# Altium project MD015A.PrjPcb (part 3 of 3)

## Sheet MD015A_MCU_USB2HUB.SchDoc
size 431 x 279 mm; Date: Not shown in title block; ApprovedBy: Not shown in title block; CheckedBy: Not shown in title block; Author: Not shown in title block; CompanyName: Not shown in title block; Engineer: Not shown in title block; Organization: Not shown in title block; Address1: Not shown in title block; Address2: Not shown in title block; Address3: Not shown in title block; Address4: Not shown in title block; DocumentNumber: 1; Revision: Use project parameter SCH_Rev; SheetNumber: 1; SheetTotal: 4; PageSetup: Record=PageOptions|CenterHorizontal=True|CenterVertical=True|PrintScale=1.00|XCorrection=1.00|YCorrection=1.00|PrintKind=0|BorderSize=5000000|LeftOffset=0|BottomOffset=0|Orientation=2|PaperLength=1000|PaperWidth=1000|Scale=100|PaperSource=15|PrintQuality=600|MediaType=1|DitherType=10|PaperKind=Letter|PrintScaleMode=1; CurrentTime: Not shown in title block; CurrentDate: Not shown in title block; Time: Not shown in title block; DocumentFullPathAndName: Not shown in title block; DocumentName: Not shown in title block; ModifiedDate: Not shown in title block; ImagePath: Not shown in title block
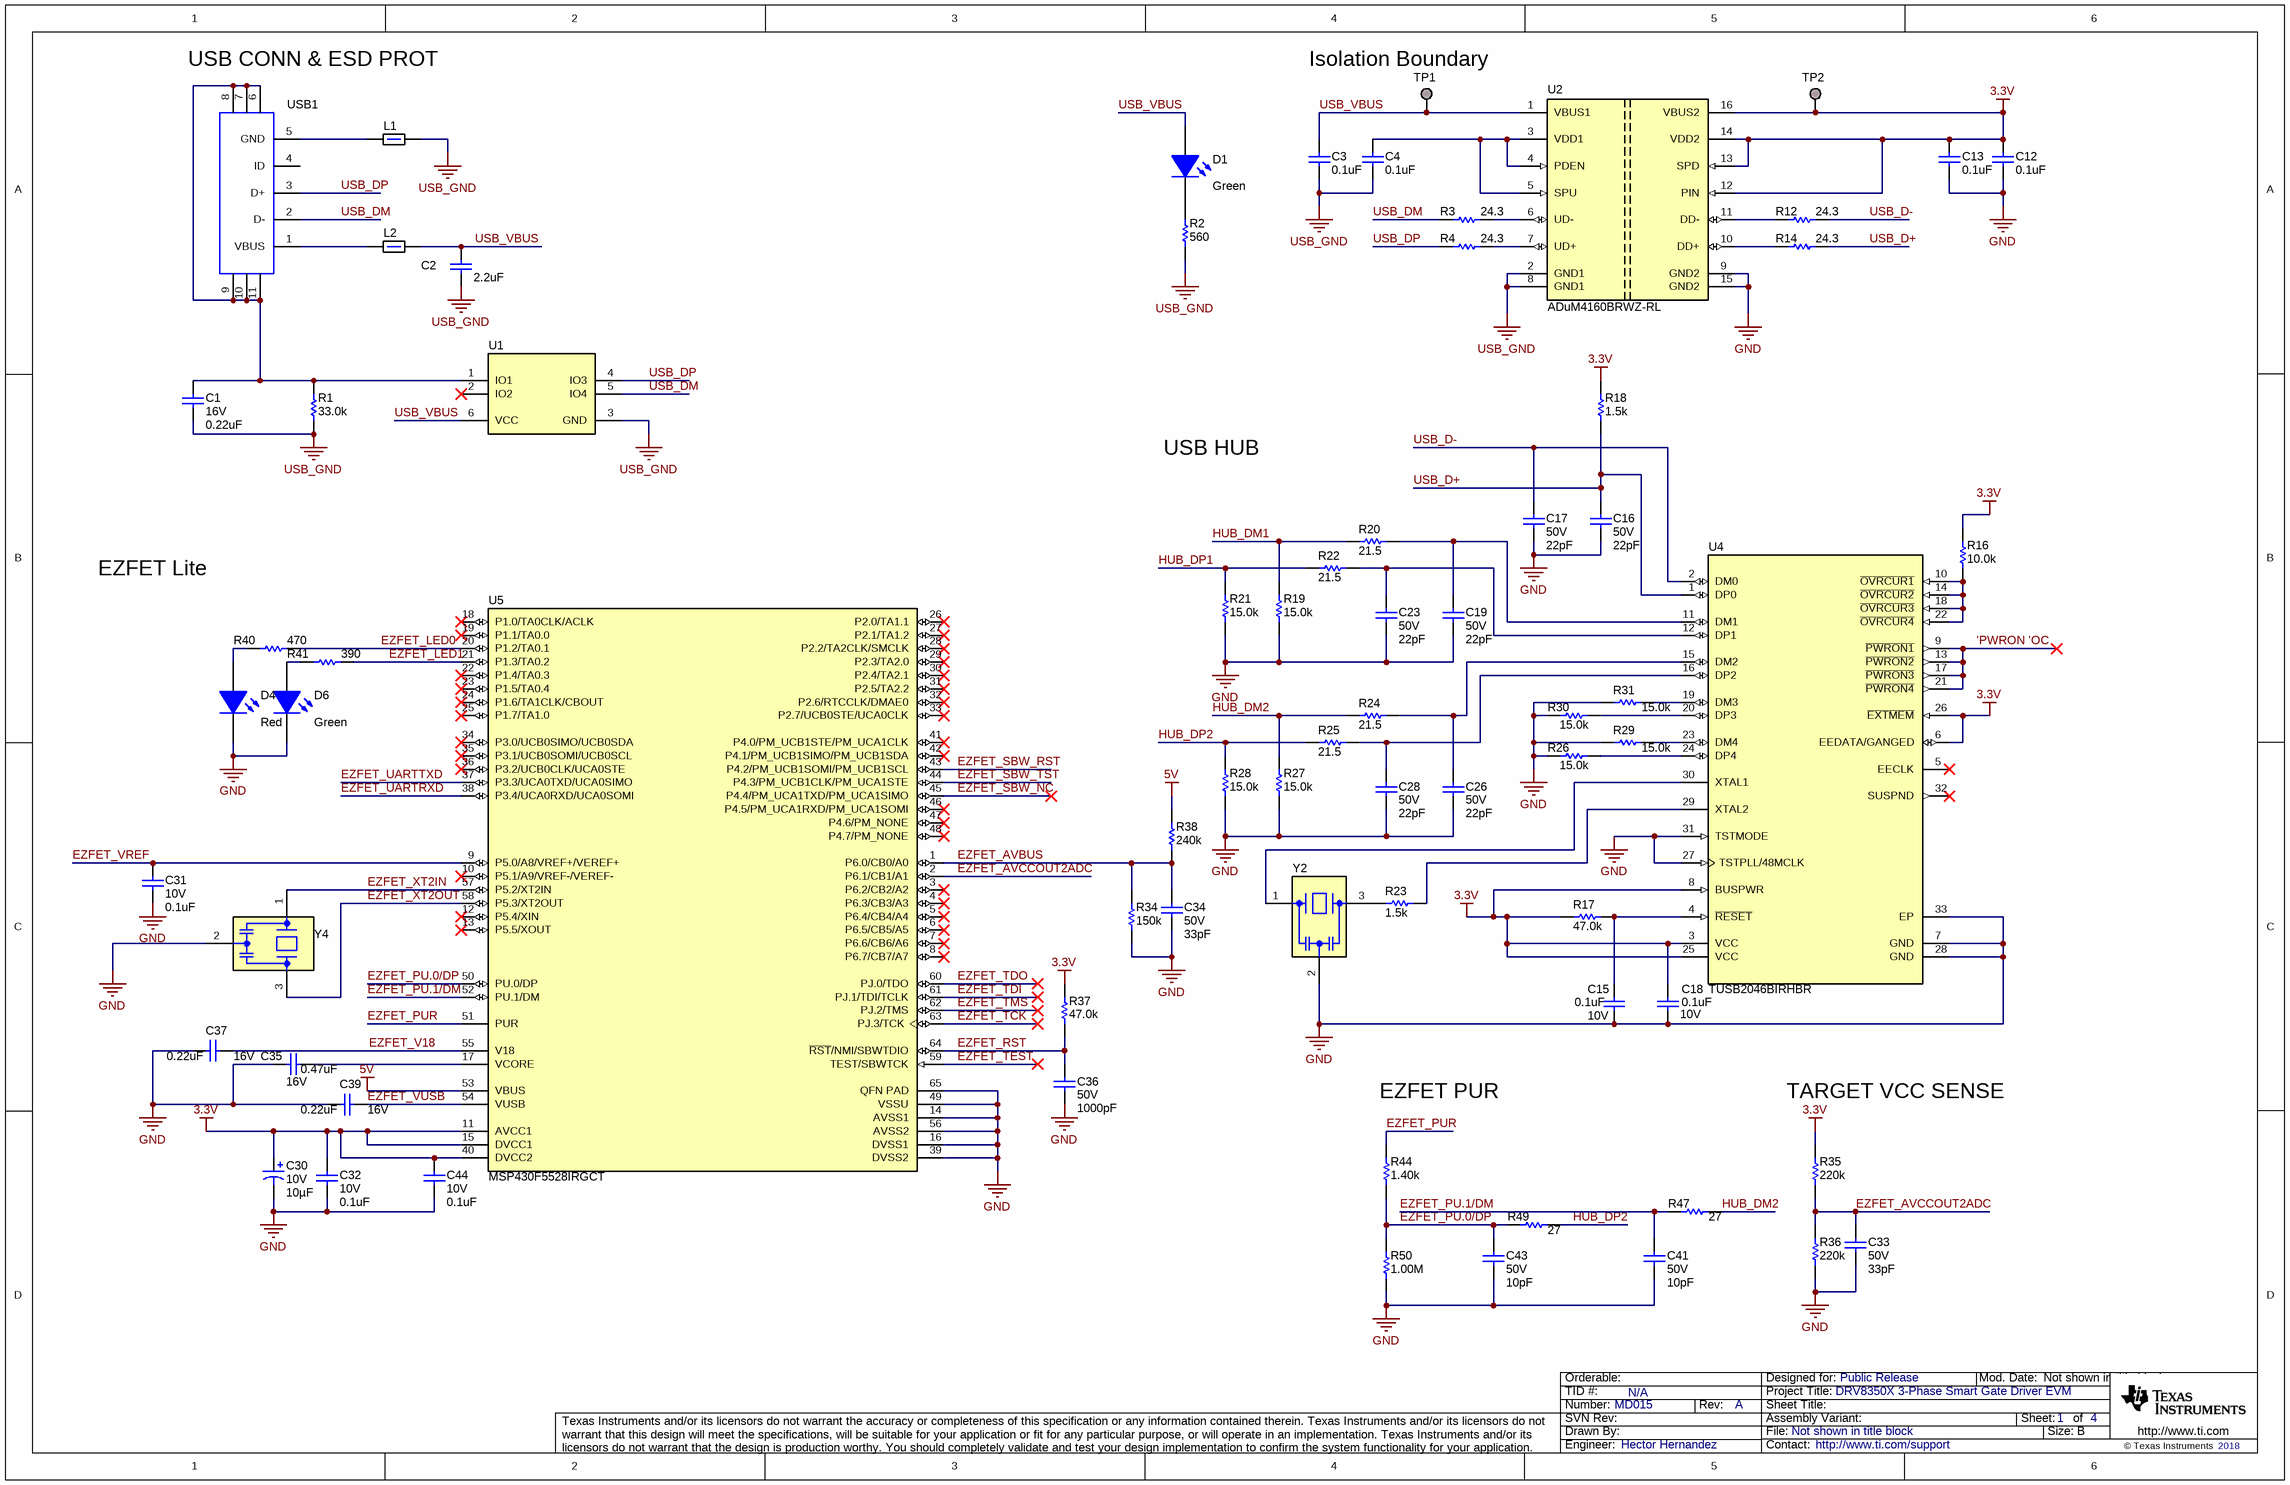
[diagram p3: MD015A_MCU_USB2HUB.SchDoc]

### Parts
C1  VDC_V: 16V  ValueDisplayed: 0.22uF  [0402L]  (hidden comment: GRM155R71C224KA12D)
C2  ValueDisplayed: 2.2uF  [0402L]  (hidden comment: GRM155R60J225KE95D)
C3  ValueDisplayed: 0.1uF  [0402L]  (hidden comment: GRM155R71A104KA01D)
C4  ValueDisplayed: 0.1uF  [0402L]  (hidden comment: GRM155R71A104KA01D)
C12  ValueDisplayed: 0.1uF  [0402L]  (hidden comment: GRM155R71A104KA01D)
C13  ValueDisplayed: 0.1uF  [0402L]  (hidden comment: GRM155R71A104KA01D)
C15  VDC_V: 10V  ValueDisplayed: 0.1uF  [0402L]  (hidden comment: 885012105010)
C16  VDC_V: 50V  ValueDisplayed: 22pF  [0402L]  (hidden comment: C1005C0G1H220J050BA)
C17  VDC_V: 50V  ValueDisplayed: 22pF  [0402L]  (hidden comment: C1005C0G1H220J050BA)
C18  VDC_V: 10V  ValueDisplayed: 0.1uF  [0402L]  (hidden comment: 885012105010)
C19  VDC_V: 50V  ValueDisplayed: 22pF  [0402L]  (hidden comment: C1005C0G1H220J050BA)
C23  VDC_V: 50V  ValueDisplayed: 22pF  [0402L]  (hidden comment: C1005C0G1H220J050BA)
C26  VDC_V: 50V  ValueDisplayed: 22pF  [0402L]  (hidden comment: C1005C0G1H220J050BA)
C28  VDC_V: 50V  ValueDisplayed: 22pF  [0402L]  (hidden comment: C1005C0G1H220J050BA)
C30  VDC_V: 10V  ValueDisplayed: 10µF  [3216-18]  (hidden comment: T520A106M010ATE080)
C31  VDC_V: 10V  ValueDisplayed: 0.1uF  [0402L]  (hidden comment: 885012105010)
C32  VDC_V: 10V  ValueDisplayed: 0.1uF  [0402L]  (hidden comment: 885012105010)
C33  VDC_V: 50V  ValueDisplayed: 33pF  [0603L]  (hidden comment: C0603C330J5GACTU)
C34  VDC_V: 50V  ValueDisplayed: 33pF  [0603L]  (hidden comment: C0603C330J5GACTU)
C35  VDC_V: 16V  ValueDisplayed: 0.47uF  [0603L]  (hidden comment: GCM188R71C474KA55D)
C36  VDC_V: 50V  ValueDisplayed: 1000pF  [0402L]  (hidden comment: 885012205061)
C37  VDC_V: 16V  ValueDisplayed: 0.22uF  [0402L]  (hidden comment: C1005X5R1C224K050BB)
C39  VDC_V: 16V  ValueDisplayed: 0.22uF  [0402L]  (hidden comment: C1005X5R1C224K050BB)
C41  VDC_V: 50V  ValueDisplayed: 10pF  [0402L]  (hidden comment: 04025U100CAT2A)
C43  VDC_V: 50V  ValueDisplayed: 10pF  [0402L]  (hidden comment: 04025U100CAT2A)
C44  VDC_V: 10V  ValueDisplayed: 0.1uF  [0402L]  (hidden comment: 885012105010)
D1  value Green  [LTST-C170KGKT_Green]  (hidden comment: LTST-C170KGKT)
D4  value Red  [LED_LTST-C190_Red]  (hidden comment: LTST-C190CKT)
D6  value Green  [LED_LTST-C190]  (hidden comment: LTST-C190GKT)
L1  742792620  [0603L]  (value not drawn)
L2  742792620  [0603L]  (value not drawn)
R1  ValueDisplayed: 33.0k  [0402L]  (hidden comment: RC0402FR-0733KL)
R2  ValueDisplayed: 560  [0603L]  (hidden comment: RG1608P-561-B-T5)
R3  ValueDisplayed: 24.3  [0402L]  (hidden comment: CRCW040224R3FKED)
R4  ValueDisplayed: 24.3  [0402L]  (hidden comment: CRCW040224R3FKED)
R12  ValueDisplayed: 24.3  [0402L]  (hidden comment: CRCW040224R3FKED)
R14  ValueDisplayed: 24.3  [0402L]  (hidden comment: CRCW040224R3FKED)
R16  ValueDisplayed: 10.0k  [0402L]  (hidden comment: MCR01MRTF1002)
R17  ValueDisplayed: 47.0k  [0402L]  (hidden comment: RC0402FR-0747KL)
R18  ValueDisplayed: 1.5k  [0402L]  (hidden comment: CRCW04021K50JNED)
R19  ValueDisplayed: 15.0k  [0402L]  (hidden comment: RC0402FR-0715KL)
R20  ValueDisplayed: 21.5  [0402L]  (hidden comment: CRCW040221R5FKED)
R21  ValueDisplayed: 15.0k  [0402L]  (hidden comment: RC0402FR-0715KL)
R22  ValueDisplayed: 21.5  [0402L]  (hidden comment: CRCW040221R5FKED)
R23  ValueDisplayed: 1.5k  [0402L]  (hidden comment: CRCW04021K50JNED)
R24  ValueDisplayed: 21.5  [0402L]  (hidden comment: CRCW040221R5FKED)
R25  ValueDisplayed: 21.5  [0402L]  (hidden comment: CRCW040221R5FKED)
R26  ValueDisplayed: 15.0k  [0402L]  (hidden comment: RC0402FR-0715KL)
R27  ValueDisplayed: 15.0k  [0402L]  (hidden comment: RC0402FR-0715KL)
R28  ValueDisplayed: 15.0k  [0402L]  (hidden comment: RC0402FR-0715KL)
R29  ValueDisplayed: 15.0k  [0402L]  (hidden comment: RC0402FR-0715KL)
R30  ValueDisplayed: 15.0k  [0402L]  (hidden comment: RC0402FR-0715KL)
R31  ValueDisplayed: 15.0k  [0402L]  (hidden comment: RC0402FR-0715KL)
R34  ValueDisplayed: 150k  [0402L]  (hidden comment: ERJ-2RKF1503X)
R35  ValueDisplayed: 220k  [0402L]  (hidden comment: RC0402FR-07220KL)
R36  ValueDisplayed: 220k  [0402L]  (hidden comment: RC0402FR-07220KL)
R37  ValueDisplayed: 47.0k  [0402L]  (hidden comment: RC0402FR-0747KL)
R38  ValueDisplayed: 240k  [0402L]  (hidden comment: ERJ-2RKF2403X)
R40  ValueDisplayed: 470  [0402L]  (hidden comment: ERJ-2RKF4700X)
R41  ValueDisplayed: 390  [0402L]  (hidden comment: CRCW0402390RJNED)
R44  ValueDisplayed: 1.40k  [0402L]  (hidden comment: ERJ-2RKF1401X)
R47  ValueDisplayed: 27  [0402L]  (hidden comment: CRCW040227R0JNED)
R49  ValueDisplayed: 27  [0402L]  (hidden comment: CRCW040227R0JNED)
R50  ValueDisplayed: 1.00M  [0402L]  (hidden comment: ERJ-2RKF1004X)
TP1  TP_SM_1MM  [TP_SM_1MM]  (value not drawn)  (no BOM)
TP2  TP_SM_1MM  [TP_SM_1MM]  (value not drawn)  (no BOM)
U1  TPD4E004DRYR  [DRY0006A]  (value not drawn)
U2  ADuM4160BRWZ-RL  [SOIC-16]
U4  TUSB2046BIRHBR  [RHB0032E]
U5  MSP430F5528IRGCT  [RGC0064B]
USB1  1051640001  [Molex_1051640001]  (value not drawn)
Y2  CSTNR6M00GH5L000R0  [MuRata_CSTNR]  (value not drawn)
Y4  CSTNR4M00GH5L000R0  [MuRata_CSTNR]  (value not drawn)

### Nets
3.3V: C12.2 C13.2 C18.1 C30.1(+) C32.1 C44.1 R16.2 R17.2 R18.2 R35.2 R37.2 TP2.1 U2.12(PIN) U2.13(SPD) U2.14(VDD2) U2.16(VBUS2) U4.3(VCC) U4.6(EEDATA/GANGED) U4.8(BUSPWR) U4.25(VCC) U4.26(~{EXTMEM}) U5.11(AVCC1) U5.15(DVCC1) U5.40(DVCC2)
5V: R38.1 U5.53(VBUS)  [project net VBUS]
GND: C12.1 C13.1 C15.2 C16.2 C17.2 C18.2 C19.2 C23.2 C26.2 C28.2 C30.2(-) C31.2 C32.2 C33.2 C34.2 C35.1 C36.2 C37.1 C39.1 C41.2 C43.2 C44.2 D4.2(K) D6.2(K) R19.1 R21.1 R26.2 R27.1 R28.1 R29.2 R30.2 R31.2 R34.1 R36.1 R50.1 U2.9(GND2) U2.15(GND2) U4.7(GND) U4.27(TSTPLL/48MCLK) U4.28(GND) U4.31(TSTMODE) U4.33(EP) U5.14(AVSS1) U5.16(DVSS1) U5.39(DVSS2) U5.49(VSSU) U5.56(AVSS2) U5.65(QFN_PAD) Y2.2(GND) Y4.2(GND)
USB_GND: C1.2 C2.2 C3.1 C4.1 L1.2 R1.1 R2.1 U1.3(GND) U2.2(GND1) U2.8(GND1)
'PWRON 'OC: U4.9(~{PWRON1}) U4.13(~{PWRON2}) U4.17(~{PWRON3}) U4.21(~{PWRON4})
EZFET_AVBUS: C34.1 R34.2 R38.2 U5.1(P6.0/CB0/A0)
EZFET_AVCCOUT2ADC: C33.1 R35.1 R36.2 U5.2(P6.1/CB1/A1)
EZFET_LED0: R40.2 U5.20(P1.2/TA0.1)
EZFET_LED1: R41.1 U5.21(P1.3/TA0.2)
EZFET_PU.0/DP: C43.1 R44.1 R49.2 R50.2 U5.50(PU.0/DP)
EZFET_PU.1/DM: C41.1 R47.2 U5.52(PU.1/DM)
EZFET_PUR: R44.2 U5.51(PUR)
EZFET_RST: C36.1 R37.1 U5.64(~{RST}/NMI/SBWTDIO)
EZFET_SBW_NC: U5.45(P4.4/PM_UCA1TXD/PM_UCA1SIMO)
EZFET_SBW_RST: U5.43(P4.2/PM_UCB1SOMI/PM_UCB1SCL)
EZFET_SBW_TST: U5.44(P4.3/PM_UCB1CLK/PM_UCA1STE)
EZFET_TCK: U5.63(PJ.3/TCK)
EZFET_TDI: U5.61(PJ.1/TDI/TCLK)
EZFET_TDO: U5.60(PJ.0/TDO)
EZFET_TEST: U5.59(TEST/SBWTCK)
EZFET_TMS: U5.62(PJ.2/TMS)
EZFET_UARTRXD: U5.38(P3.4/UCA0RXD/UCA0SOMI)
EZFET_UARTTXD: U5.37(P3.3/UCA0TXD/UCA0SIMO)
EZFET_V18: C37.2 U5.55(V18)
EZFET_VREF: C31.1 U5.9(P5.0/A8/VREF+/VEREF+)
EZFET_VUSB: C39.2 U5.54(VUSB)
EZFET_XT2IN: U5.57(P5.2/XT2IN) Y4.1(In)
EZFET_XT2OUT: U5.58(P5.3/XT2OUT) Y4.3(Out)
HUB_DM1: R19.2 R20.2
HUB_DM2: R24.2 R27.2 R47.1
HUB_DP1: R21.2 R22.2
HUB_DP2: R25.2 R28.2 R49.1
USB_D+: C16.1 R14.2 R18.1 U4.1(DP0)
USB_D-: C17.1 R12.2 U4.2(DM0)
USB_DM: R3.1 U1.5(IO4) USB1.2(D-)
USB_DP: R4.1 U1.4(IO3) USB1.3(D+)
USB_VBUS: C2.1 C3.2 D1.1(A) L2.2 TP1.1 U1.6(VCC) U2.1(VBUS1)
NetC1_1: C1.1 R1.2 U1.1(IO1) USB1.6 USB1.7 USB1.8 USB1.9 USB1.10 USB1.11
NetC4_2: C4.2 U2.3(VDD1) U2.4(PDEN) U2.5(SPU)
NetC15_1: C15.1 R17.1 U4.4(~{RESET})
NetC19_1: C19.1 R20.1 U4.11(DM1)
NetC23_1: C23.1 R22.1 U4.12(DP1)
NetC26_1: C26.1 R24.1 U4.15(DM2)
NetC28_1: C28.1 R25.1 U4.16(DP2)
NetC35_2: C35.2 U5.17(VCORE)
NetD1_2: D1.2(K) R2.2
NetD4_1: D4.1(A) R40.1
NetD6_1: D6.1(A) R41.2
NetL1_1: L1.1 USB1.5(GND)
NetL2_1: L2.1 USB1.1(VBUS)
NetR3_2: R3.2 U2.6(UD-)
NetR4_2: R4.2 U2.7(UD+)
NetR12_1: R12.1 U2.11(DD-)
NetR14_1: R14.1 U2.10(DD+)
NetR16_1: R16.1 U4.10(~{OVRCUR1}) U4.14(~{OVRCUR2}) U4.18(~{OVRCUR3}) U4.22(~{OVRCUR4})
NetR23_1: R23.1 U4.29(XTAL2)
NetR23_2: R23.2 Y2.3(Out)
NetR26_1: R26.1 U4.24(DP4)
NetR29_1: R29.1 U4.23(DM4)
NetR30_1: R30.1 U4.20(DP3)
NetR31_1: R31.1 U4.19(DM3)
NetU4_30: U4.30(XTAL1) Y2.1(In)

Not connected (* = marked no-connect by the designer): U1 2(IO2)*; U4 5(EECLK)* 32(SUSPND)*; U5 3(P6.2/CB2/A2)* 4(P6.3/CB3/A3)* 5(P6.4/CB4/A4)* 6(P6.5/CB5/A5)* 7(P6.6/CB6/A6)* 8(P6.7/CB7/A7)* 10(P5.1/A9/VREF-/VEREF-)* 12(P5.4/XIN)* 13(P5.5/XOUT)* 18(P1.0/TA0CLK/ACLK)* 19(P1.1/TA0.0)* 22(P1.4/TA0.3)* 23(P1.5/TA0.4)* 24(P1.6/TA1CLK/CBOUT)* 25(P1.7/TA1.0)* 26(P2.0/TA1.1)* 27(P2.1/TA1.2)* 28(P2.2/TA2CLK/SMCLK)* 29(P2.3/TA2.0)* 30(P2.4/TA2.1)* 31(P2.5/TA2.2)* 32(P2.6/RTCCLK/DMAE0)* 33(P2.7/UCB0STE/UCA0CLK)* 34(P3.0/UCB0SIMO/UCB0SDA)* 35(P3.1/UCB0SOMI/UCB0SCL)* 36(P3.2/UCB0CLK/UCA0STE)* 41(P4.0/PM_UCB1STE/PM_UCA1CLK)* 42(P4.1/PM_UCB1SIMO/PM_UCB1SDA)* 46(P4.5/PM_UCA1RXD/PM_UCA1SOMI)* 47(P4.6/PM_NONE)* 48(P4.7/PM_NONE)*; USB1 4(ID)

### Notes on the sheet
- (near USB1) USB CONN & ESD PROT
- (near TP1) Isolation Boundary
- USB HUB
- EZFET Lite
- EZFET PUR
- TARGET VCC SENSE
- Drawn By:
- SVN Rev:
- Number:
- TID #:
- Orderable:
- Rev:
- Sheet Title:
- File:
- Project Title:
- Designed for:
- Assembly Variant:
- Mod. Date:
- Sheet:
- Size:
- of
- B
- http://www.ti.com
- Texas Instruments and/or its licensors do not warrant the accuracy or completeness of this specification or any information contained therein. Texas Instruments and/or its licensors do not warrant that this design will meet the specifications, will be suitable for your application or fit for any particular purpose, or will operate in an implementation. Texas Instruments and/or its licensors do not warrant that the design is production worthy. You should completely validate and test your design implementation to confirm the system functionality for your application.
- Engineer:
- Contact:
- © Texas Instruments

### Library data of the parts
C1 = CMP-0006648-2: CAP, CERM, 0.22 uF, 16 V, +/- 10%, X7R, 0402; Manufacturer: MuRata; TaMin_C: -55°C; Polarized: N; SizeAreaWB_mm2: 3; Value1: Unknown; U/M: EA; Value: 0.22uF; TaMax_C: 125°C; SizeZ_mm: 0.6; SizeX_mm: 1; SizeY_mm: 0.5; Cap_Case: 0402; Cap_F: 220nF; AEC Category: Q200; ComponentLink1URL: http://search.murata.co.jp/Ceramy/PnsearchViewAction.do?HnOFG=ON&HnNFG=ON&SEL_CNT=50&sLang=en&sKey=GRM155R71C224KA12D&x=9&y=9&search=startwith; Supplier Part Number 2: 81-GRM155R71C224KA2D; Publisher: Texas Instruments; Supplier 2: Mouser; TempCo: X7R; Published: 2008-06-19; RoHS: Y; MountType: SMT; Supplier 1: Digi-Key; PackageReference: 0402; Tolerance_%: 10%; Value2: 16V; SizeArea_mm2: 0.5; CompType: Capacitor; LatestRevisionDate: 2017-03-09; PartNumber: GRM155R71C224KA12D; AEC Qualified: ?; ComponentLink1Description: Datasheet link; Supplier Part Number 1: 490-5418-1-ND; Technology: Ceramic
C2 = CMP-0006543-2: CAP, CERM, 2.2 uF, 6.3 V, +/- 10%, X5R, 0402; Manufacturer: MuRata; Polarized: N; Value: 2.2uF; U/M: EA; Cap_F: 2.2µF; Value1: Unknown; VDC_V: 6.3V; TaMin_C: -55°C; TaMax_C: 85°C; Cap_Case: 0402; SizeArea_mm2: 0.5; SizeAreaWB_mm2: 3; SizeX_mm: 1; SizeZ_mm: 0.6; AEC Category: Q200; CompType: Capacitor; PartNumber: GRM155R60J225KE95D; PackageReference: 0402; RoHS: Y; Tolerance_%: 10%; Value2: 6.3V; MountType: SMT; Technology: Ceramic; TempCo: X5R; SizeY_mm: 0.5; Published: 2008-06-19; Publisher: Texas Instruments; LatestRevisionDate: 2017-03-09; ComponentLink1Description: Datasheet link; ComponentLink1URL: http://psearch.en.murata.com/capacitor/product/GRM155R60J225KE95%23.pdf; Supplier 1: Mouser; Supplier Part Number 1: 81-GRM155R60J225KE5D; AEC Qualified: N; AEC Grade: N/A
C3 C4 C12 C13 = CMP-0006629-2: CAP, CERM, 0.1 uF, 10 V, +/- 10%, X7R, 0402; Manufacturer: MuRata; Polarized: N; Value: 0.1uF; U/M: EA; Cap_F: 100nF; Value1: Unknown; VDC_V: 10V; TaMin_C: -55°C; TaMax_C: 125°C; Cap_Case: 0402; SizeArea_mm2: 0.5; SizeAreaWB_mm2: 3; SizeX_mm: 1; SizeZ_mm: 0.6; AEC Category: Q200; CompType: Capacitor; PartNumber: GRM155R71A104KA01D; PackageReference: 0402; RoHS: Y; Tolerance_%: 10%; Value2: 10V; MountType: SMT; Technology: Ceramic; TempCo: X7R; SizeY_mm: 0.5; Published: 2008-06-19; Publisher: Texas Instruments; LatestRevisionDate: 2017-03-09; ComponentLink1Description: Datasheet link; ComponentLink1URL: http://search.murata.co.jp/Ceramy/PnsearchViewAction.do?HnOFG=ON&HnNFG=ON&SEL_CNT=50&sLang=en&sKey=GRM155R71A104KA01D&x=9&y=9&search=startwith; Supplier 1: Digi-Key; Supplier Part Number 1: GRM155R71A104KA01D-ND; Supplier 2: Newark; Supplier Part Number 2: 14T3278; Supplier 3: Mouser; Supplier Part Number 3: 81-GRM155R71A104KA1D; AEC Qualified: ?
C15 C18 C31 C32 C44 = CMP-0006221-2: CAP, CERM, 0.1 uF, 10 V, +/- 20%, X5R, 0402; Manufacturer: Wurth Elektronik; TaMin_C: -55°C; Polarized: N; SizeAreaWB_mm2: 3; Value1: Unknown; U/M: EA; Value: 0.1uF; TaMax_C: 85°C; SizeZ_mm: 0.6; SizeX_mm: 1; SizeY_mm: 0.5; Cap_Case: 0402; Cap_F: 100nF; AEC Category: Q200; Supplier Part Number 2: 710-885012105010; Publisher: Texas Instruments; Supplier 2: Mouser; TempCo: X5R; Published: 2008-06-19; RoHS: Y; MountType: SMT; Supplier 1: Digi-Key; PackageReference: 0402; Tolerance_%: 20%; Value2: 10V; SizeArea_mm2: 0.5; CompType: Capacitor; LatestRevisionDate: 2017-03-09; PartNumber: 885012105010; AEC Qualified: N; ComponentLink1Description: Datasheet link; AEC Grade: N/A; Supplier Part Number 1: 732-7487-1-ND; Technology: Ceramic; ComponentLink1URL: http://katalog.we-online.de/pbs/datasheet/885012105010.pdf
C16 C17 C19 C23 C26 C28 = CMP-0006248-2: CAP, CERM, 22 pF, 50 V, +/- 5%, C0G/NP0, 0402; Manufacturer: TDK; TaMin_C: -55°C; Polarized: N; SizeAreaWB_mm2: 3; Value1: Unknown; U/M: EA; Value: 22pF; TaMax_C: 125°C; SizeZ_mm: 0.6; SizeX_mm: 1; SizeY_mm: 0.5; Cap_Case: 0402; AEC Category: Q200; Supplier Part Number 2: 55T0064; Publisher: Texas Instruments; Supplier 2: Newark; Supplier Part Number 3: 810-C1005C0G1H220J; TempCo: C0G/NP0; Supplier 3: Mouser; Published: 2008-06-19; RoHS: Y; MountType: SMT; Supplier 1: Digi-Key; PackageReference: 0402; Tolerance_%: 5%; Value2: 50V; SizeArea_mm2: 0.5; CompType: Capacitor; LatestRevisionDate: 2017-03-09; PartNumber: C1005C0G1H220J050BA; AEC Qualified: ?; Cap_F: 22pF; ComponentLink1Description: Datasheet link; Supplier Part Number 1: 445-1239-1-ND; Technology: Ceramic; ComponentLink1URL: http://product.tdk.com/en/catalog/datasheets/mlcc_commercial_general_en.pdf
C30 = CMP-0084376-1: CAP, Tantalum Polymer, 10 µF, 10 V,+/- 20%, 0.08 ohm, 3216-18 SMD; Manufacturer: Kemet; TaMin_C: -55°C; SizeArea_mm2: 5.12; Value: 10uF; SizeAreaWB_mm2: 10.92; SizeY_mm: 1.6; Polarized: Y; SizeX_mm: 3.2; AEC Qualified: N; TaMax_C: 105°C; SizeZ_mm: 1.8; ESR_ohm: 0.08; CompType: Capacitor; AEC Category: Q200; PackageReference: 3216-18; Technology: Tantalum Polymer; Cap_Case: 3216-18; ComponentLink1URL: https://content.kemet.com/datasheets/KEM_T2076_T52X-530.pdf; ComponentLink1Description: Datasheet link; PartNumber: T520A106M010ATE080; Value1: 0.08 ohm; MountType: SMT; Value2: 10V; Cap_F: 10µF; RoHS: Y; Series: T520; Tolerance_%: 20%; AEC Grade: N/A
C33 C34 = CMP-0006919-4: CAP, CERM, 33 pF, 50 V, +/- 5%, C0G/NP0, 0603; Manufacturer: Kemet; TaMin_C: -55°C; Polarized: N; SizeAreaWB_mm2: 4.68; Value1: Unknown; U/M: EA; Value: 33pF; TaMax_C: 125°C; SizeZ_mm: 1; SizeX_mm: 1.6; SizeY_mm: 0.8; Cap_Case: 0603; SizeArea_mm2: 1.28; AEC Category: Q200; Supplier Part Number 2: 80-C0603C330J5G; Publisher: Texas Instruments; Supplier 2: Mouser; Supplier Part Number 3: 1414633; TempCo: C0G/NP0; Supplier 3: Farnell; Published: 2008-06-19; RoHS: Y; MountType: SMT; Supplier 1: Digi-Key; PackageReference: 0603; Tolerance_%: 5%; Value2: 50V; CompType: Capacitor; LatestRevisionDate: 2017-03-09; PartNumber: C0603C330J5GACTU; AEC Qualified: ?; Cap_F: 33pF; ComponentLink1Description: Datasheet link; Supplier Part Number 1: 399-1055-1-ND; Technology: Ceramic; ComponentLink1URL: http://www.kemet.com/kemet/web/homepage/kechome.nsf/vapubfiles/F3102_Y5V.pdf/$file/F3102_Y5V.pdf
C35 = CMP-0007138-4: CAP, CERM, 0.47 uF, 16 V, +/- 10%, X7R, AEC-Q200 Grade 1, 0603; Manufacturer: MuRata; TaMin_C: -55°C; Polarized: N; SizeAreaWB_mm2: 4.68; Value1: Unknown; U/M: EA; Value: 0.47uF; TaMax_C: 125°C; SizeZ_mm: 1; SizeX_mm: 1.6; SizeY_mm: 0.8; Cap_Case: 0603; SizeArea_mm2: 1.28; AEC Qualified: Y; Cap_F: 470nF; AEC Category: Q200; Supplier Part Number 2: 45Y5163; Publisher: Texas Instruments; Supplier 2: Newark; TempCo: X7R; Published: 2008-06-19; RoHS: Y; MountType: SMT; Supplier 1: Digi-Key; PackageReference: 0603; Tolerance_%: 10%; Value2: 16V; CompType: Capacitor; LatestRevisionDate: 2017-03-09; PartNumber: GCM188R71C474KA55D; ComponentLink1Description: Datasheet link; AEC Grade: 1; Supplier Part Number 1: 490-4775-1-ND; Technology: Ceramic; ComponentLink1URL: http://psearch.en.murata.com/capacitor/product/GCM188R71C474KA55%23.pdf
C36 = CMP-0006231-2: CAP, CERM, 1000 pF, 50 V, +/- 10%, X7R, 0402; Manufacturer: Wurth Elektronik; TaMin_C: -55°C; Polarized: N; SizeAreaWB_mm2: 3; Value1: Unknown; U/M: EA; Value: 1000pF; TaMax_C: 125°C; SizeZ_mm: 0.6; SizeX_mm: 1; SizeY_mm: 0.5; Cap_Case: 0402; Cap_F: 1nF; AEC Category: Q200; Supplier Part Number 2: 710-885012205061; Publisher: Texas Instruments; Supplier 2: Mouser; TempCo: X7R; Published: 2008-06-19; RoHS: Y; MountType: SMT; Supplier 1: Digi-Key; PackageReference: 0402; Tolerance_%: 10%; Value2: 50V; SizeArea_mm2: 0.5; CompType: Capacitor; LatestRevisionDate: 2017-03-09; PartNumber: 885012205061; AEC Qualified: N; ComponentLink1Description: Datasheet link; AEC Grade: N/A; Supplier Part Number 1: 732-7556-1-ND; Technology: Ceramic; ComponentLink1URL: http://katalog.we-online.de/pbs/datasheet/885012205061.pdf
C37 C39 = CMP-0006274-2: CAP, CERM, 0.22 uF, 16 V, +/- 10%, X5R, 0402; Manufacturer: TDK; TaMin_C: -55°C; Polarized: N; SizeAreaWB_mm2: 3; Value1: Unknown; U/M: EA; Value: 0.22uF; TaMax_C: 85°C; SizeZ_mm: 0.6; SizeX_mm: 1; SizeY_mm: 0.5; Cap_Case: 0402; Cap_F: 220nF; AEC Category: Q200; Supplier Part Number 2: 90R7592; Publisher: Texas Instruments; Supplier 2: Newark; Supplier Part Number 3: 810-C1005X5R1C224K; TempCo: X5R; Supplier 3: Mouser; Published: 2008-06-19; RoHS: Y; MountType: SMT; Supplier 1: Digi-Key; PackageReference: 0402; Tolerance_%: 10%; Value2: 16V; SizeArea_mm2: 0.5; CompType: Capacitor; LatestRevisionDate: 2017-03-09; PartNumber: C1005X5R1C224K050BB; AEC Qualified: N; ComponentLink1Description: Datasheet link; AEC Grade: N/A; Supplier Part Number 1: 445-4972-1-ND; Technology: Ceramic; ComponentLink1URL: https://product.tdk.com/info/en/documents/chara_sheet/C1005X5R1C224K050BB.pdf
C41 C43 = CMP-0064911-2: CAP, CERM, 10 pF, 50 V,+/- 2.5%, C0G/NP0, AEC-Q200 Grade 1, 0402; Manufacturer: AVX; TaMin_C: -55°C; Polarized: N; SizeAreaWB_mm2: 3; Value1: Unknown; U/M: EA; Value: 10pF; TaMax_C: 125°C; SizeZ_mm: 0.6; SizeX_mm: 1; SizeY_mm: 0.5; Cap_Case: 0402; AEC Qualified: Y; AEC Category: Q200; Supplier Part Number 2: 95W9098; Publisher: Texas Instruments; Supplier 2: Newark; Supplier Part Number 3: 581-04025U100CAT2A; TempCo: C0G/NP0; Supplier 3: Mouser; Published: 2008-06-19; RoHS: Y; MountType: SMT; Supplier 1: Digi-Key; PackageReference: 0402; Tolerance_%: 2.5%; Value2: 50V; SizeArea_mm2: 0.5; CompType: Capacitor; LatestRevisionDate: 2017-06-05; PartNumber: 04025U100CAT2A; Cap_F: 10pF; ComponentLink1Description: Datasheet link; AEC Grade: 1; Supplier Part Number 1: 478-5991-1-ND; Technology: Ceramic; ComponentLink1URL: http://datasheets.avx.com/AutoU_Series.pdf
D1 = CMP-0002888-2: LED, Green, SMD; Manufacturer: Lite-On; Value1: W; Vf_V: 2V; Type: AlInGaP; Io_A: 20mA; MountType: SMT; Color: Green; ComponentLink1URL: http://optoelectronics.liteon.com/upload/download/DS22-2000-073/S_110_LTST-C170KGKT.pdf; RoHS: Y; PackageReference: LED_0805; ComponentLink1Description: Datasheet link; PartNumber: LTST-C170KGKT; Value2: 2V; CompType: LED
D4 = CMP-0002842-2: LED, Red, SMD; Manufacturer: Lite-On; Power_TotalModule: 62.5mW; Value1: 0.0625W; Io_A: 20mA; Value2: 2V; Tjmax_C: 85°C; RoHS: Y; Type: ?; ComponentLink1URL: http://optoelectronics.liteon.com/en-us/api/DwonloadFileHandler.ashx?txtSpecNo=DS-22-98-0009&txtPartNo=LTST-C190CKT; PackageReference: Red LED, 1.6x0.8x0.8mm; PartNumber: LTST-C190CKT; MountType: SMT; ComponentLink1Description: Datasheet link; CompType: LED; Color: red; Vf_V: 2V
D6 = CMP-0002827-3: LED, Green, SMD; Manufacturer: Lite-On; Power_TotalModule: 100mW; Value2: 2.1V; Io_A: 20mA; Value1: 0.1W; ComponentLink1Description: Datasheet link; PackageReference: 1.6x0.8x0.8mm; CompType: LED; Type: ?; ComponentLink1URL: https://sps06.itg.ti.com/sites/KMS/crossdivteams/altium/docs/ComponentDatasheets/LTST-C190GKT.pdf; Color: green; Vf_V: 2.1V; PartNumber: LTST-C190GKT; RoHS: Y; MountType: SMT
L1 L2 = CMP-0003183-2: Ferrite Bead, 100 ohm @ 100 MHz, 0.5 A, 0603; Manufacturer: Wurth Elektronik; Ztyp@1GHz_Ohm: 137.267; ZTyp@100MHz_Ohm: 100; SizeAreaWB_mm2: 4.68; DCR_ohm: 0.15; Value1: 0.15 ohm; Value: 100 ohm; Imax_A: 500mA; SizeZ_mm: 1; SizeX_mm: 1.6; SizeY_mm: 0.8; Value2: 0.5A; SizeArea_mm2: 1.28; ComponentLink1URL: http://katalog.we-online.de/pbs/datasheet/742792620.pdf; Supplier Part Number 2: 710-742792620; Publisher: Texas Instruments; Supplier 2: Mouser; Published: 2014-04-30; RoHS: Y; MountType: SMT; Supplier 1: Digi-Key; PackageReference: 0603; CompType: Ferrite Bead; LatestRevisionDate: 2017-03-09; PartNumber: 742792620; ComponentLink1Description: Datasheet link; Supplier Part Number 1: 732-1579-1-ND; ValueDisplayed: 100 ohm
R1 = CMP-0078584-1: RES, 33.0 k, 1%, 0.063 W, 0402; Manufacturer: Yageo America; Power_W: 63mW; TempCo: 100 ppm/C; Value_Code: 33k0; Value: 33.0k; Res_ohm: 33k; SizeX_mm: 1; SizeY_mm: 0.5; SizeZ_mm: 0.6; Value2: 0.063W; AEC Qualified: N; AEC Category: Q200; ComponentLink1URL: http://www.yageo.com/documents/recent/PYu-RC_Group_51_RoHS_L_8.pdf; Supplier Part Number 2: 98K7539; Supplier 2: Newark; Supplier Part Number 3: 603-RC0402FR-0733KL; Supplier 3: Mouser; RoHS: Y; Value1: 1%; MountType: SMT; Supplier 1: Digi-Key; PackageReference: 0402; Tolerance_%: 1%; SizeArea_mm2: 0.5; CompType: Resistor; PartNumber: RC0402FR-0733KL; ComponentLink1Description: Datasheet link; AEC Grade: N/A; Supplier Part Number 1: 311-33.0KLRCT-ND; Technology: Thick Film
R2 = CMP-0023573-3: RES, 560, 0.1%, 0.1 W, 0603; Manufacturer: Susumu Co Ltd; Power_W: 100mW; TempCo: 25 ppm/C; Value_Code: 560R; U/M: EA; Value: 560; SizeX_mm: 1.6; SizeY_mm: 0.8; SizeZ_mm: 1; Value2: 0.1W; SizeArea_mm2: 1.28; VDC_V: 75V; AEC Category: Q200; ComponentLink1URL: http://www.susumu.co.jp/english/pdf/products-j01-01.pdf; Supplier Part Number 2: 754-RG1608P-561-BT5; Publisher: Texas Instruments; Supplier 2: Mouser; Published: 2008-06-26; RoHS: Y; Value1: 0.1%; MountType: SMT; Supplier 1: Digi-Key; PackageReference: 0603; Tolerance_%: 0.1%; Res_ohm: 560; CompType: Resistor; LatestRevisionDate: 2017-03-09; PartNumber: RG1608P-561-B-T5; AEC Qualified: ?; ComponentLink1Description: Datasheet link; Supplier Part Number 1: RG16P560BCT-ND; Technology: Metal Film
R3 R4 R12 R14 = CMP-0026197-2: RES, 24.3, 1%, 0.063 W, AEC-Q200 Grade 0, 0402; Manufacturer: Vishay-Dale; Value: 24.3; Value_Code: 24R3; Power_W: 63mW; Value2: 0.063W; VDC_V: 50V; TempCo: 100 ppm/C; SizeArea_mm2: 0.5; SizeX_mm: 1; SizeZ_mm: 0.6; EIA_Code: E96; AEC Category: Q200; AEC Qualified: Y; AEC Grade: 0; CompType: Resistor; PartNumber: CRCW040224R3FKED; PackageReference: 0402; RoHS: E; Res_ohm: 24.3; Tolerance_%: 1%; Value1: 1%; MountType: SMT; Technology: Thick Film; SizeY_mm: 0.5; ComponentLink1Description: Datasheet link; ComponentLink1URL: http://www.vishay.com/docs/20035/dcrcwe3.pdf; Supplier 1: Digi-Key; Supplier Part Number 1: 541-24.3LCT-ND; Supplier 2: Newark; Supplier Part Number 2: 52K6877; Supplier 3: Mouser; Supplier Part Number 3: 71-CRCW0402-24.3-E3
R16 = CMP-0026793-1: RES, 10.0 k, 0.1%, 0.063 W, 0402; Manufacturer: Rohm; Power_W: 63mW; TempCo: 100 ppm/C; Value_Code: 10k0; U/M: EA; Value: 10.0k; EIA_Code: E192; Res_ohm: 10k; SizeX_mm: 1; SizeY_mm: 0.5; SizeZ_mm: 0.6; Value2: 0.063W; AEC Qualified: N; VDC_V: 50V; AEC Category: Q200; ComponentLink1URL: http://rohmfs.rohm.com/en/products/databook/datasheet/passive/resistor/chip_resistor/mcr_g.pdf; Publisher: Texas Instruments; Published: 2008-06-26; RoHS: Y; Value1: 0.1%; MountType: SMT; Supplier 1: Digi-Key; PackageReference: 0402; Tolerance_%: 0.1%; SizeArea_mm2: 0.5; CompType: Resistor; LatestRevisionDate: 2017-03-09; PartNumber: MCR01MRTF1002; ComponentLink1Description: Datasheet link; AEC Grade: N/A; Supplier Part Number 1: RHM10.0KCDCT-ND; Technology: Thick Film
R17 R37 = CMP-0026737-1: RES, 47.0 k, 1%, 0.0625 W, 0402; Manufacturer: Yageo America; Power_W: 62.5mW; TempCo: 100 ppm/C; Value_Code: 47k0; U/M: EA; Value: 47.0k; Res_ohm: 47k; SizeX_mm: 1; SizeY_mm: 0.5; SizeZ_mm: 0.6; AEC Qualified: N; VDC_V: 50V; AEC Category: Q200; ComponentLink1URL: http://www.yageo.com/documents/recent/PYu-RC0402_51_RoHS_L_6_r.pdf; Supplier Part Number 2: 67R9937; Publisher: Texas Instruments; Supplier 2: Newark; Supplier Part Number 3: 603-RC0402FR-0747KL; Supplier 3: Mouser; Published: 2008-06-26; RoHS: Y; Value1: 1%; MountType: SMT; Supplier 1: Digi-Key; PackageReference: 0402; Tolerance_%: 1%; Value2: 0.0625W; SizeArea_mm2: 0.5; CompType: Resistor; LatestRevisionDate: 2017-03-09; PartNumber: RC0402FR-0747KL; ComponentLink1Description: Datasheet link; AEC Grade: N/A; Supplier Part Number 1: 311-47.0KLRCT-ND; Technology: Thick Film
R18 R23 = CMP-0026856-5: RES, 1.5 k, 5%, 0.063 W, AEC-Q200 Grade 0, 0402; Manufacturer: Vishay-Dale; Power_W: 63mW; TempCo: 200 ppm/C; Value_Code: 1k50; Value: 1.5k; EIA_Code: E24; SizeX_mm: 1; SizeY_mm: 0.5; SizeZ_mm: 0.6; Value2: 0.063W; AEC Qualified: Y; VDC_V: 50V; AEC Category: Q200; AEC Grade: 0; Supplier Part Number 2: 72M6746; Supplier 2: Newark; Supplier Part Number 3: 71-CRCW0402J-1.5K-E3; Supplier 3: Mouser; RoHS: E; Value1: 5%; MountType: SMT; Supplier 1: Digi-Key; PackageReference: 0402; Tolerance_%: 5%; Res_ohm: 1.5k; SizeArea_mm2: 0.5; CompType: Resistor; PartNumber: CRCW04021K50JNED; ComponentLink1Description: Datasheet link; Supplier Part Number 1: 541-1.5KJCT-ND; Technology: Thick Film; ComponentLink1URL: http://www.vishay.com/docs/20035/dcrcwe3.pdf
R19 R21 R26-R31 = CMP-0078583-1: RES, 15.0 k, 1%, 0.063 W, 0402; Manufacturer: Yageo America; Power_W: 63mW; Green_Lifecycle: Active; TempCo: 100 ppm/C; Value_Code: 15k0; Green_REACh: Passed; Value: 15.0k; EIA_Code: E96; Res_ohm: 15k; SizeX_mm: 1; SizeY_mm: 0.5; SizeZ_mm: 0.6; Value2: 0.063W; AEC Qualified: N; AEC Category: Q200; ComponentLink1URL: http://www.yageo.com/documents/recent/PYu-RC_Group_51_RoHS_L_8.pdf; Supplier Part Number 2: 67R9898; Supplier 2: Newark; Supplier Part Number 3: 603-RC0402FR-0715KL; Supplier 3: Mouser; RoHS: Y; Value1: 1%; MountType: SMT; Green_EU RoHS-2: Passed; Supplier 1: Digi-Key; Green_EU RoHS: Passed with Exemption; PackageReference: 0402; Tolerance_%: 1%; SizeArea_mm2: 0.5; CompType: Resistor; PartNumber: RC0402FR-0715KL; ComponentLink1Description: Datasheet link; AEC Grade: N/A; Supplier Part Number 1: 311-15.0KLRCT-ND; Technology: Thick Film
R20 R22 R24 R25 = CMP-0026173-2: RES, 21.5, 1%, 0.063 W, AEC-Q200 Grade 0, 0402; Manufacturer: Vishay-Dale; Power_W: 63mW; TempCo: 100 ppm/C; Value_Code: 21R5; Value: 21.5; EIA_Code: E96; SizeX_mm: 1; SizeY_mm: 0.5; SizeZ_mm: 0.6; Value2: 0.063W; AEC Qualified: Y; VDC_V: 50V; AEC Category: Q200; AEC Grade: 0; ComponentLink1URL: http://www.vishay.com/docs/20035/dcrcwe3.pdf; Supplier Part Number 2: 71-CRCW0402-21.5-E3; Supplier 2: Mouser; Supplier Part Number 3: 1156951; Supplier 3: Farnell; RoHS: E; Value1: 1%; MountType: SMT; Supplier 1: Digi-Key; PackageReference: 0402; Tolerance_%: 1%; Res_ohm: 21.5; SizeArea_mm2: 0.5; CompType: Resistor; PartNumber: CRCW040221R5FKED; ComponentLink1Description: Datasheet link; Supplier Part Number 1: 541-21.5LCT-ND; Technology: Thick Film
R34 = CMP-0026669-1: RES, 150 k, 1%, 0.1 W, AEC-Q200 Grade 0, 0402; Manufacturer: Panasonic; Power_W: 100mW; TempCo: 100 ppm/C; U/M: EA; Value: 150k; EIA_Code: E96; SizeX_mm: 1; SizeY_mm: 0.5; SizeZ_mm: 0.6; Value2: 0.1W; AEC Qualified: Y; VDC_V: 50V; AEC Grade: 0; AEC Category: Q200; ComponentLink1URL: http://industrial.panasonic.com/cdbs/www-data/pdf/RDA0000/AOA0000CE2.pdf; Supplier Part Number 2: 64R5260; Publisher: Texas Instruments; Supplier 2: Newark; Supplier Part Number 3: 667-ERJ-2RKF1503X; Supplier 3: Mouser; Published: 2008-06-26; Value_Code: 150k; RoHS: Y; Value1: 1%; MountType: SMT; Supplier 1: Digi-Key; PackageReference: 0402; Tolerance_%: 1%; Res_ohm: 150k; SizeArea_mm2: 0.5; CompType: Resistor; LatestRevisionDate: 2017-03-09; PartNumber: ERJ-2RKF1503X; ComponentLink1Description: Datasheet link; Supplier Part Number 1: P150KLCT-ND; Technology: Thick Film
R35 R36 = CMP-0026728-1: RES, 220 k, 1%, 0.0625 W, 0402; Manufacturer: Yageo America; Power_W: 62.5mW; TempCo: 100 ppm/C; U/M: EA; Value: 220k; SizeX_mm: 1; SizeY_mm: 0.5; SizeZ_mm: 0.6; AEC Qualified: N; VDC_V: 50V; AEC Category: Q200; ComponentLink1URL: http://www.yageo.com/documents/recent/PYu-RC0402_51_RoHS_L_6_r.pdf; Supplier Part Number 2: 98K7527; Publisher: Texas Instruments; Supplier 2: Newark; Supplier Part Number 3: 603-RC0402FR-07220KL; Supplier 3: Mouser; Published: 2008-06-26; Value_Code: 220k; RoHS: Y; Value1: 1%; MountType: SMT; Supplier 1: Digi-Key; PackageReference: 0402; Tolerance_%: 1%; Res_ohm: 220k; Value2: 0.0625W; SizeArea_mm2: 0.5; CompType: Resistor; LatestRevisionDate: 2017-03-09; PartNumber: RC0402FR-07220KL; ComponentLink1Description: Datasheet link; AEC Grade: N/A; Supplier Part Number 1: 311-220KLRCT-ND; Technology: Thick Film
R38 = CMP-0026686-1: RES, 240 k, 1%, 0.1 W, AEC-Q200 Grade 0, 0402; Manufacturer: Panasonic; Power_W: 100mW; TempCo: 100 ppm/C; U/M: EA; Value: 240k; SizeX_mm: 1; SizeY_mm: 0.5; SizeZ_mm: 0.6; Value2: 0.1W; AEC Qualified: Y; VDC_V: 50V; AEC Grade: 0; AEC Category: Q200; ComponentLink1URL: http://industrial.panasonic.com/cdbs/www-data/pdf/RDA0000/AOA0000CE2.pdf; Supplier Part Number 2: 53W4287; Publisher: Texas Instruments; Supplier 2: Newark; Supplier Part Number 3: 667-ERJ-2RKF2403X; Supplier 3: Mouser; Published: 2008-06-26; Value_Code: 240k; RoHS: Y; Value1: 1%; MountType: SMT; Supplier 1: Digi-Key; PackageReference: 0402; Tolerance_%: 1%; Res_ohm: 240k; SizeArea_mm2: 0.5; CompType: Resistor; LatestRevisionDate: 2017-03-09; PartNumber: ERJ-2RKF2403X; ComponentLink1Description: Datasheet link; Supplier Part Number 1: P240KLCT-ND; Technology: Thick Film
R40 = CMP-0026699-1: RES, 470, 1%, 0.1 W, AEC-Q200 Grade 0, 0402; Manufacturer: Panasonic; Power_W: 100mW; TempCo: 100 ppm/C; Value_Code: 470R; U/M: EA; Value: 470; SizeX_mm: 1; SizeY_mm: 0.5; SizeZ_mm: 0.6; Value2: 0.1W; AEC Qualified: Y; VDC_V: 50V; AEC Grade: 0; AEC Category: Q200; ComponentLink1URL: http://industrial.panasonic.com/lecs/www-data/pdf/AOA0000/AOA0000CE2.pdf; Supplier Part Number 2: 667-ERJ-2RKF4700X; Publisher: Texas Instruments; Supplier 2: Mouser; Supplier Part Number 3: 2397145; Supplier 3: Farnell; Published: 2008-06-26; RoHS: Y; Value1: 1%; MountType: SMT; Supplier 1: Digi-Key; PackageReference: 0402; Tolerance_%: 1%; Res_ohm: 470; SizeArea_mm2: 0.5; CompType: Resistor; LatestRevisionDate: 2017-03-09; PartNumber: ERJ-2RKF4700X; ComponentLink1Description: Datasheet link; Supplier Part Number 1: P470LCT-ND; Technology: Thick Film
R41 = CMP-0026914-3: RES, 390, 5%, 0.063 W, AEC-Q200 Grade 0, 0402; Manufacturer: Vishay-Dale; Power_W: 63mW; TempCo: 200 ppm/C; Value_Code: 390R; Value: 390; EIA_Code: E24; SizeX_mm: 1; SizeY_mm: 0.5; SizeZ_mm: 0.6; Value2: 0.063W; AEC Qualified: Y; VDC_V: 50V; AEC Category: Q200; AEC Grade: 0; Supplier Part Number 2: 59M6731; Supplier 2: Newark; Supplier Part Number 3: 71-CRCW0402J-390-E3; Supplier 3: Mouser; RoHS: E; Value1: 5%; MountType: SMT; Supplier 1: Digi-Key; PackageReference: 0402; Tolerance_%: 5%; Res_ohm: 390; SizeArea_mm2: 0.5; CompType: Resistor; PartNumber: CRCW0402390RJNED; ComponentLink1Description: Datasheet link; Supplier Part Number 1: 541-390JCT-ND; Technology: Thick Film; ComponentLink1URL: http://www.vishay.com/docs/20035/dcrcwe3.pdf
R44 = CMP-0026666-1: RES, 1.40 k, 1%, 0.1 W, 0402; Manufacturer: Panasonic; Power_W: 100mW; TempCo: 100 ppm/C; Value_Code: 1k40; U/M: EA; Value: 1.40k; EIA_Code: E96; Res_ohm: 1.4k; SizeX_mm: 1; SizeY_mm: 0.5; SizeZ_mm: 0.6; Value2: 0.1W; VDC_V: 50V; AEC Category: Q200; ComponentLink1URL: http://industrial.panasonic.com/www-data/pdf/AOA0000/AOA0000CE2.pdf; Supplier Part Number 2: 51W8930; Publisher: Texas Instruments; Supplier 2: Newark; Supplier Part Number 3: 667-ERJ-2RKF1401X; Supplier 3: Mouser; Published: 2008-06-26; RoHS: Y; Value1: 1%; MountType: SMT; Supplier 1: Digi-Key; PackageReference: 0402; Tolerance_%: 1%; SizeArea_mm2: 0.5; CompType: Resistor; LatestRevisionDate: 2017-03-09; PartNumber: ERJ-2RKF1401X; AEC Qualified: ?; ComponentLink1Description: Datasheet link; Supplier Part Number 1: P1.40KLCT-ND; Technology: Thick Film
R47 R49 = CMP-0026888-3: RES, 27, 5%, 0.063 W, AEC-Q200 Grade 0, 0402; Manufacturer: Vishay-Dale; Power_W: 63mW; TempCo: 200 ppm/C; Value_Code: 27R0; Value: 27; EIA_Code: E24; SizeX_mm: 1; SizeY_mm: 0.5; SizeZ_mm: 0.6; Value2: 0.063W; AEC Qualified: Y; VDC_V: 50V; AEC Category: Q200; AEC Grade: 0; Supplier Part Number 2: 59M6721; Supplier 2: Newark; Supplier Part Number 3: 71-CRCW0402J-27-E3; Supplier 3: Mouser; RoHS: E; Value1: 5%; MountType: SMT; Supplier 1: Digi-Key; PackageReference: 0402; Tolerance_%: 5%; Res_ohm: 27; SizeArea_mm2: 0.5; CompType: Resistor; PartNumber: CRCW040227R0JNED; ComponentLink1Description: Datasheet link; Supplier Part Number 1: 541-27JCT-ND; Technology: Thick Film; ComponentLink1URL: http://www.vishay.com/docs/20035/dcrcwe3.pdf
R50 = CMP-0026660-1: RES, 1.00 M, 1%, 0.1 W, 0402; Manufacturer: Panasonic; Power_W: 100mW; TempCo: 100 ppm/C; Value_Code: 1M00; U/M: EA; Value: 1.00Meg; EIA_Code: E96; Res_ohm: 1M; SizeX_mm: 1; SizeY_mm: 0.5; SizeZ_mm: 0.6; Value2: 0.1W; VDC_V: 50V; AEC Category: Q200; ComponentLink1URL: http://industrial.panasonic.com/www-data/pdf/AOA0000/AOA0000CE2.pdf; Supplier Part Number 2: 64R5250; Publisher: Texas Instruments; Supplier 2: Newark; Supplier Part Number 3: 667-ERJ-2RKF1004X; Supplier 3: Mouser; Published: 2008-06-26; RoHS: Y; Value1: 1%; MountType: SMT; Supplier 1: Digi-Key; PackageReference: 0402; Tolerance_%: 1%; SizeArea_mm2: 0.5; CompType: Resistor; LatestRevisionDate: 2017-03-09; PartNumber: ERJ-2RKF1004X; AEC Qualified: ?; ComponentLink1Description: Datasheet link; Supplier Part Number 1: P1.00MLCT-ND; Technology: Thick Film
TP1 TP2 = CMP-0003825-1: 1mm Test Point, SMT; Manufacturer: Any; ComponentLink1URL: https://sps06.itg.ti.com/sites/KMS/crossdivteams/altium/docs/ComponentDatasheets/PROBE_TEST_POINT.png; Key: TP_SM_1MM; Publisher: Texas Instruments; CompType: Test Point; PackageReference: 1mm Test Point, SMT; LatestRevisionDate: 2017-03-09; MountType: SMT; PartNumber: TP_SM_1MM; ComponentLink1Description: Datasheet Link
U1 = CMP-0043115-3: 4-Channel ESD Protection Array for High-Speed Data Interfaces, DRY0006A (USON-6); Manufacturer: Texas Instruments; 1394 / Firewire: TRUE; Breakdown Voltage(Min)(V): 6; Eco-Plan: Green (RoHS & no Sb/Br); IEC 61000-4-2 Air-Gap(+/- kV): 12; IEC 61000-4-2 Contact(+/- kV): 8; IO Capacitance(Typ)(pF): 1.6; IO Leakage Current(nA): 1; AEC Category: Q200; AEC Qualified: N; CompType: IC; SizeArea_mm2: 1.45; SizeAreaWB_mm2: 4.9; SizeX_mm: 1.0; SizeZ_mm: 0.6; Rating: Catalog; PackageReference: DRY0006A; PackageDescription: USON-6; Serial ATA / eSATA: TRUE; USB High Speed: TRUE; PartNumber: TPD4E004DRYR; ComponentLink1Description: Datasheet Link; ComponentLink1URL: http://www.ti.com/lit/ds/symlink/tpd4e004.pdf; ComponentLink2Description: Product Folder; ComponentLink2URL: http://www.ti.com/product/tpd4e004; ComponentLink3Description: Online Datasheet; ComponentLink3URL: http://www.ti.com/product/tpd4e004/datasheet; MountType: SMT; RoHS: Y; SizeY_mm: 1.45; Operating Temperature Range: -40 to 85 C
U2 = CMP-0005064-3: Full/Low Speed 5 kV USB Digital Isolator, SOIC-16; Manufacturer: Analog Devices; Publisher: Texas Instruments; Supplier Part Number 2: 24R9005; Supplier 3: Mouser; Supplier 1: Digi-Key; PackageReference: SOIC, 16-Leads, Body 10.3x7.5mm, Pitch 1.27mm; LatestRevisionDate: 09/03/2017; RoHS: Y; Supplier Part Number 1: ADUM4160BRWZ-RLCT-ND; Supplier Part Number 3: 584-ADUM4160BRWZ-R; Supplier 2: Newark; MountType: SMT; PartNumber: ADuM4160BRWZ-RL; ComponentLink1Description: Datasheet URL; ComponentLink1URL: http://www.analog.com/media/en/technical-documentation/data-sheets/ADuM4160.pdf
U4 = CMP-0033741-2: 4-Port Full-Speed USB Hub, 3.3V, -40 to 85 degC, 32-Pin QFN (RHB), Green (RoHS & no Sb/Br); Manufacturer: Texas Instruments; SubFamily: USB Hub Controller; Supply Voltage(s)(V): 3.3; USB Speed: Full; USB Full Speed: True; PackageReference: RHB0032E; Eco-Plan: Green (RoHS & no Sb/Br); Code_JEDEC: MO-220; Integrated MCU Architecture: N/A; PackageDescription: 32-Pin Plastic Quad Flat No-Lead, 5 x 5 mm Body, 0.5 mm Pitch, 3.45 x 3.45 mm Exposed Pad; Mounting Technology: Surface Mount; ComponentLink2Description: Package Specification; PartNumber: TUSB2046BIRHBR; ComponentLink2URL: http://www.ti.com/litv/pdf/mpqf130c; ComponentLink1URL: http://www.ti.com/general/docs/lit/getliterature.tsp?genericPartNumber=TUSB2046B&fileType=pdf; PackageVersion: revD, Jun-2011; DatasheetVersion: SLLS413H; ComponentLink1Description: Datasheet
U5 = CMP-0039269-4: 16-Bit Ultra-Low-Power Microcontroller, 128KB Flash, 8KB RAM, USB, 12Bit ADC, 2 USCIs, 32Bit HW MPY, RGC0064B (VQFN-64); Manufacturer: Texas Instruments; Alternate PartNumber: MSP430F5528IRGCR; USB: 1; DMA: 3; Multiplier: 32x32; ADC: 12-bit SAR; Real-Time Clock: Yes; USCI_B (I2C & SPI): 2; Frequency(MHz): 25; Timers - 16-bit: 4; GPIO: 47; ADC Channels: 16; Flash(KB): 128; SRAM(B): 8192; CompType: IC; SizeAreaWB_mm2: 121.0; SizeArea_mm2: 81.0; SizeX_mm: 9.0; SizeZ_mm: 1.0; AEC Category: Q200; AEC Qualified: N; Green_Lifecycle: Active; Green_REACh: Passed; Rating: Catalog; PackageDescription: VQFN-64; ComponentLink3URL: http://www.ti.com/product/msp430f5528/datasheet; ComponentLink2Description: Product Folder; PartNumber: MSP430F5528IRGCT; ComponentLink2URL: http://www.ti.com/product/msp430f5528; ComponentLink1URL: http://www.ti.com/lit/ds/symlink/msp430f5528.pdf; ComponentLink3Description: Online Datasheet; ComponentLink1Description: Datasheet Link; PackageReference: RGC0064B; USCI_A (UART/LIN/IrDA/SPI): 2; Watchdog: Yes; Brown Out Reset: Yes; SVS: Yes; Comparators: Yes; Temp Sensor: Yes; MountType: SMT; SizeY_mm: 9.0; RoHS: Y; Alternate Manufacturer: Texas Instruments; Green_EU RoHS: Passed; Green_EU RoHS-2: Passed; Operating Temperature Range: -40 to 85 C
USB1 = CMP-0055311-1: Receptacle, USB 2.0, Micro B, 5 Position, R/A, SMT; Manufacturer: Molex; Pitch_mm: 0.65; Gender: Female; ContactFinish: Gold; Current_A: 1.8A; Voltage_V: 30V; Cert_UL: Y; CNHeader: FALSE; CT: TRUE; PartNumber: 1051640001; PackageReference: Receptacle, USB 2.0, Micro B, 5 Pos, 0.65mm Pitch, R/A, SMT; CompType: USB; RoHS: Y; MountType: SMT; ComponentLink1Description: Datasheet URL; ComponentLink1URL: http://www.molex.com/pdm_docs/sd/1051640001_sd.pdf; Orientation: R/A; PinCount: 5; Color: Black; Publisher: Texas Instruments; LatestRevisionDate: 26/05/2017; Supplier 1: Digi-Key; Supplier Part Number 1: WM11263CT-ND; Supplier 2: Newark; Supplier Part Number 2: 99Y3224; Supplier 3: Mouser; Supplier Part Number 3: 538-105164-0001
Y2 = CMP-0085484-1: Oscillator, 6 MHz, 700 ppm, 39 pF, SMD; Manufacturer: MuRata; SizeArea_mm2: 9; AEC Category: Q200; SizeY_mm: 2; Load Capacitance: 39 pF; TaMin_C: -20°C; Frequency_Fixed: 6MHz; AEC Qualified: N; Frequency Tolerance: 700 ppm; SizeX_mm: 4.5; SizeZ_mm: 1.2; TaMax_C: 85°C; SizeAreaWB_mm2: 16.5; PackageReference: 4.5x2mm; ComponentLink1URL: https://www.murata.com/en-us/products/productdata/8801161642014/SPEC-CSTNR4M00GH5L000R0.pdf?1521430204000; MountType: SMT; CompType: Oscillator; ComponentLink1Description: Datasheet Link; RoHS: Y; AEC Grade: N/A; PartNumber: CSTNR6M00GH5L000R0
Y4 = CMP-0085483-1: Oscillator, 4 MHz, 700 ppm, 39 pF, SMD; Manufacturer: MuRata; SizeArea_mm2: 9; Load Capacitance: 39 pF; SizeZ_mm: 1.2; AEC Category: Q200; Frequency Tolerance: 700 ppm; SizeX_mm: 4.5; SizeAreaWB_mm2: 16.5; TaMax_C: 85°C; TaMin_C: -20°C; SizeY_mm: 2; AEC Qualified: N; Frequency_Fixed: 4MHz; CompType: Oscillator; ComponentLink1URL: https://www.murata.com/en-us/products/productdata/8802049818654/SPEC-CSTNR6M00GH5L000R0.pdf?1528293605000; RoHS: Y; MountType: SMT; PackageReference: 4.5x2mm; ComponentLink1Description: Datasheet Link; AEC Grade: N/A; PartNumber: CSTNR4M00GH5L000R0

## Nets that join several sheets
3.3V: MD015A_MCU_F5529 (10 pins), MD015A (13 pins), MD015A_MCU_USB2HUB (24 pins)
GND: MD015A_MCU_F5529 (41 pins), MD015A (41 pins), MD015A_MCU_USB2HUB (50 pins)
VBUCK: MD015A_MCU_F5529 (7 pins), MD015A (R72.1)
VBUS: MD015A_MCU_F5529 (7 pins), MD015A (D7.1 J1.1), MD015A_MCU_USB2HUB (R38.1 U5.53)
VM: MD015A_MCU_F5529 (C56.1 C62.1 R57.1 U8.8), MD015A (25 pins)
ENABLE: MD015A_MCU_F5529 (U3.27), MD015A (U9.22)
EZFET_SBW_RST: MD015A_MCU_F5529 (C11.1 R7.1 S1.2 U3.76), MD015A_MCU_USB2HUB (U5.43)
EZFET_SBW_TST: MD015A_MCU_F5529 (U3.71), MD015A_MCU_USB2HUB (U5.44)
EZFET_UARTRXD: MD015A_MCU_F5529 (U3.51), MD015A_MCU_USB2HUB (U5.38)
EZFET_UARTTXD: MD015A_MCU_F5529 (U3.52), MD015A_MCU_USB2HUB (U5.37)
HALLA: MD015A_MCU_F5529 (U3.29), MD015A (C38.1 J2.2 R42.1 R46.2)
HALLB: MD015A_MCU_F5529 (U3.31), MD015A (C40.1 J2.3 R43.1 R48.2)
HALLC: MD015A_MCU_F5529 (U3.35), MD015A (C42.1 J2.4 R45.1 R51.2)
HUB_DM1: MD015A_MCU_F5529 (R6.2), MD015A_MCU_USB2HUB (R19.2 R20.2)
HUB_DP1: MD015A_MCU_F5529 (R11.2), MD015A_MCU_USB2HUB (R21.2 R22.2)
INHA: MD015A_MCU_F5529 (U3.34), MD015A (U9.23)
INHB: MD015A_MCU_F5529 (U3.26), MD015A (R48.1 U9.25)
INHC: MD015A_MCU_F5529 (U3.24), MD015A (U9.27)
INLA: MD015A_MCU_F5529 (U3.33), MD015A (R46.1 U9.24)
INLB: MD015A_MCU_F5529 (U3.25), MD015A (R51.1 U9.26)
INLC: MD015A_MCU_F5529 (U3.23), MD015A (U9.28)
ISEN: MD015A_MCU_F5529 (U3.5), MD015A (C29.1 R32.1)
LP LED: MD015A_MCU_F5529 (U3.45), MD015A (D3.1)
MODE: MD015A_MCU_F5529 (U3.48), MD015A (R66.1)
nFAULT: MD015A_MCU_F5529 (U3.36), MD015A (R70.1 R71.1 U9.17)
nSCS/NC: MD015A_MCU_F5529 (U3.32), MD015A (U9.21)
POT: MD015A_MCU_F5529 (U3.3), MD015A (R5.2)
SCLK: MD015A_MCU_F5529 (U3.39), MD015A (R61.1)
SDI: MD015A_MCU_F5529 (U3.37), MD015A (R64.1)
SDO: MD015A_MCU_F5529 (U3.38), MD015A (R67.1)
VSENA: MD015A_MCU_F5529 (U3.77), MD015A (C74.1 R81.2 R83.1 U10.1)
VSENB: MD015A_MCU_F5529 (U3.78), MD015A (C73.1 R79.2 R82.1 U10.2)
VSENC: MD015A_MCU_F5529 (U3.79), MD015A (C72.1 R78.2 R80.1 U10.4)
VSENVM: MD015A_MCU_F5529 (U3.2), MD015A (C68.1 R76.2 R77.1 U10.5)

## Assembly variants
001: not fitted C72 C73 C74 FID1 FID2 FID3 R46 R48 R51 R59 R60 R62 R63 R65 R66 R68
002: not fitted C72 C73 C74 FID1 FID2 FID3 R46 R48 R51 R60 R61 R63 R64 R67 R68 R69; alternate parts U9 -> CMP-0014025-2, R9 -> CMP-0023540-3